# EAGLE design SVL-AuxiliaryPower (EAGLE 7.7.0)
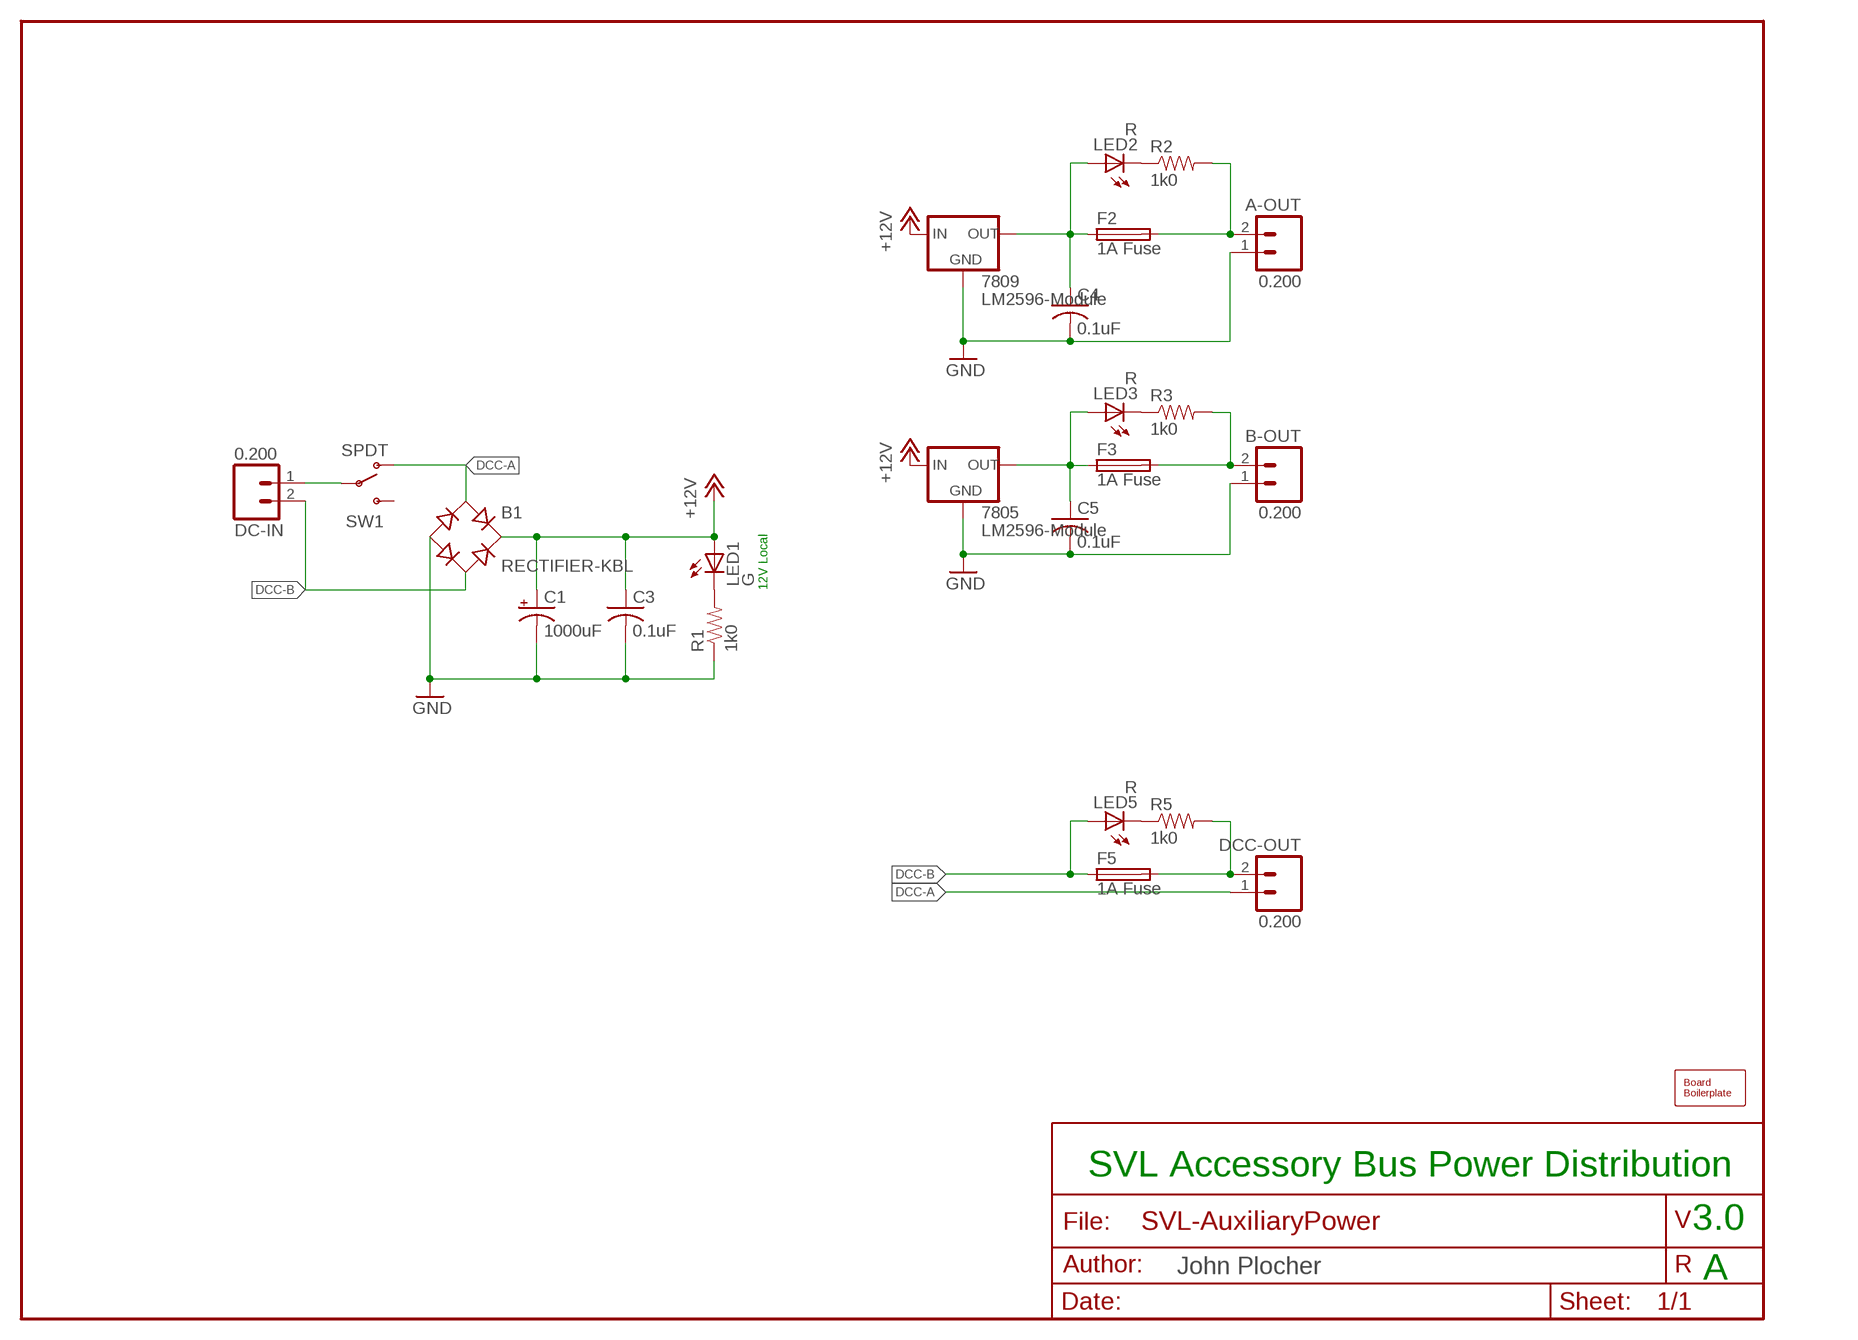
[diagram p0: schematic, sheet 1]

## Parts
7805  LM2596-Module  VREG_78XXLM2596  [LM2596-MODULE]
7809  LM2596-Module  VREG_78XXLM2596  [LM2596-MODULE]
A-OUT  0.200  CONNECTOR-M02508-LOCK  [MSTB2]
B1  RECTIFIER-KBL  [KBL]
B-OUT  0.200  CONNECTOR-M02508-LOCK  [MSTB2]
BOARD1  BOARD100X100  [BOARD-SEEED10X10]
C1  1000uF  CAP-POLPTH-5MM  [E5-10.5]
C3  0.1uF  CAPPTH1  [C050-024X044]
C4  0.1uF  CAPPTH1  [C050-024X044]
C5  0.1uF  CAPPTH1  [C050-024X044]
DC-IN  0.200  CONNECTOR-M02508-LOCK  [MSTB2]
DCC-OUT  0.200  CONNECTOR-M02508-LOCK  [MSTB2]
F2  1A Fuse  PICOFUSEPOLY  [POLYFUSE]
F3  1A Fuse  PICOFUSEPOLY  [POLYFUSE]
F5  1A Fuse  PICOFUSEPOLY  [POLYFUSE]
LED1  G  LEDLED5MM  [LED5MM]
LED2  R  LEDLED5MM  [LED5MM]
LED3  R  LEDLED5MM  [LED5MM]
LED5  R  LEDLED5MM  [LED5MM]
R1  1k0  RPTH04  [AXIAL-0.4-RES]
R2  1k0  RPTH04  [AXIAL-0.4-RES]
R3  1k0  RPTH04  [AXIAL-0.4-RES]
R5  1k0  RPTH04  [AXIAL-0.4-RES]
SW1  SPDT  SWITCH-SPSTPTH-508  [SWITCH-SPDT-508]

## Nets
+12V: 7805.IN+@1(IN) 7805.IN+@2(IN) 7809.IN+@1(IN) 7809.IN+@2(IN) B1.+ C1.+ C3.1 LED1.A
DCC-A: B1.AC1 DCC-OUT.1 SW1.1(O)
DCC-B: B1.AC2 DC-IN.2 F5.1 LED5.A
GND: 7805.GND@1(GND) 7805.GND@2(GND) 7805.GND@3(GND) 7805.GND@4(GND) 7809.GND@1(GND) 7809.GND@2(GND) 7809.GND@3(GND) 7809.GND@4(GND) A-OUT.1 B1.- B-OUT.1 C1.- C3.2 C4.2 C5.2 R1.P$1
N$2: A-OUT.2 F2.2 R2.P$2
N$3: B-OUT.2 F3.2 R3.P$2
N$4: DCC-OUT.2 F5.2 R5.P$2
N$5: 7809.OUT+@1(OUT) 7809.OUT+@2(OUT) C4.1 F2.1 LED2.A
N$7: 7805.OUT+@1(OUT) 7805.OUT+@2(OUT) C5.1 F3.1 LED3.A
N$8: LED2.K(C) R2.P$1
N$10: LED3.K(C) R3.P$1
N$12: LED1.K(C) R1.P$2
N$13: LED5.K(C) R5.P$1
UNSWITCHED-DCC-A: DC-IN.1 SW1.2(P)
Unconnected: SW1.3(S)

## Notes on the sheet
- 12V Local
- SVL Accessory Bus Power Distribution
- 3.0
- A

## Library data of the parts
7805 7809 = SPCoast:VREG_78XX: Voltage Regulator Standard 7805 5V regulator. IGO (Input Ground Output). Spark Fun Electronics SKU : COM-00107
A-OUT B-OUT DC-IN DCC-OUT = SPCoast:CONNECTOR-M02: PHOENIX CONNECTOR
B1 = rectifier:RECTIFIER-: Rectifier
BOARD1 = SPCoast:BOARD
C1 = SPCoast:CAP-POL*
C3-C5 = SPCoast:CAP*
F2 F3 F5 = SPCoast:PICOFUSE: PICOFUSE 19275, Wickmann
LED1-LED3 LED5 = SPCoast:LED*
R1-R3 R5 = SPCoast:R*: Resistor Basic schematic elements and footprints for 0603, 1206, and PTH 1/10th watt (small) resistors.
SW1 = SPCoast:SWITCH-SPST: SPST Switch Simple slide switch. Spark Fun Electronics SKU : COM-00102

## Board
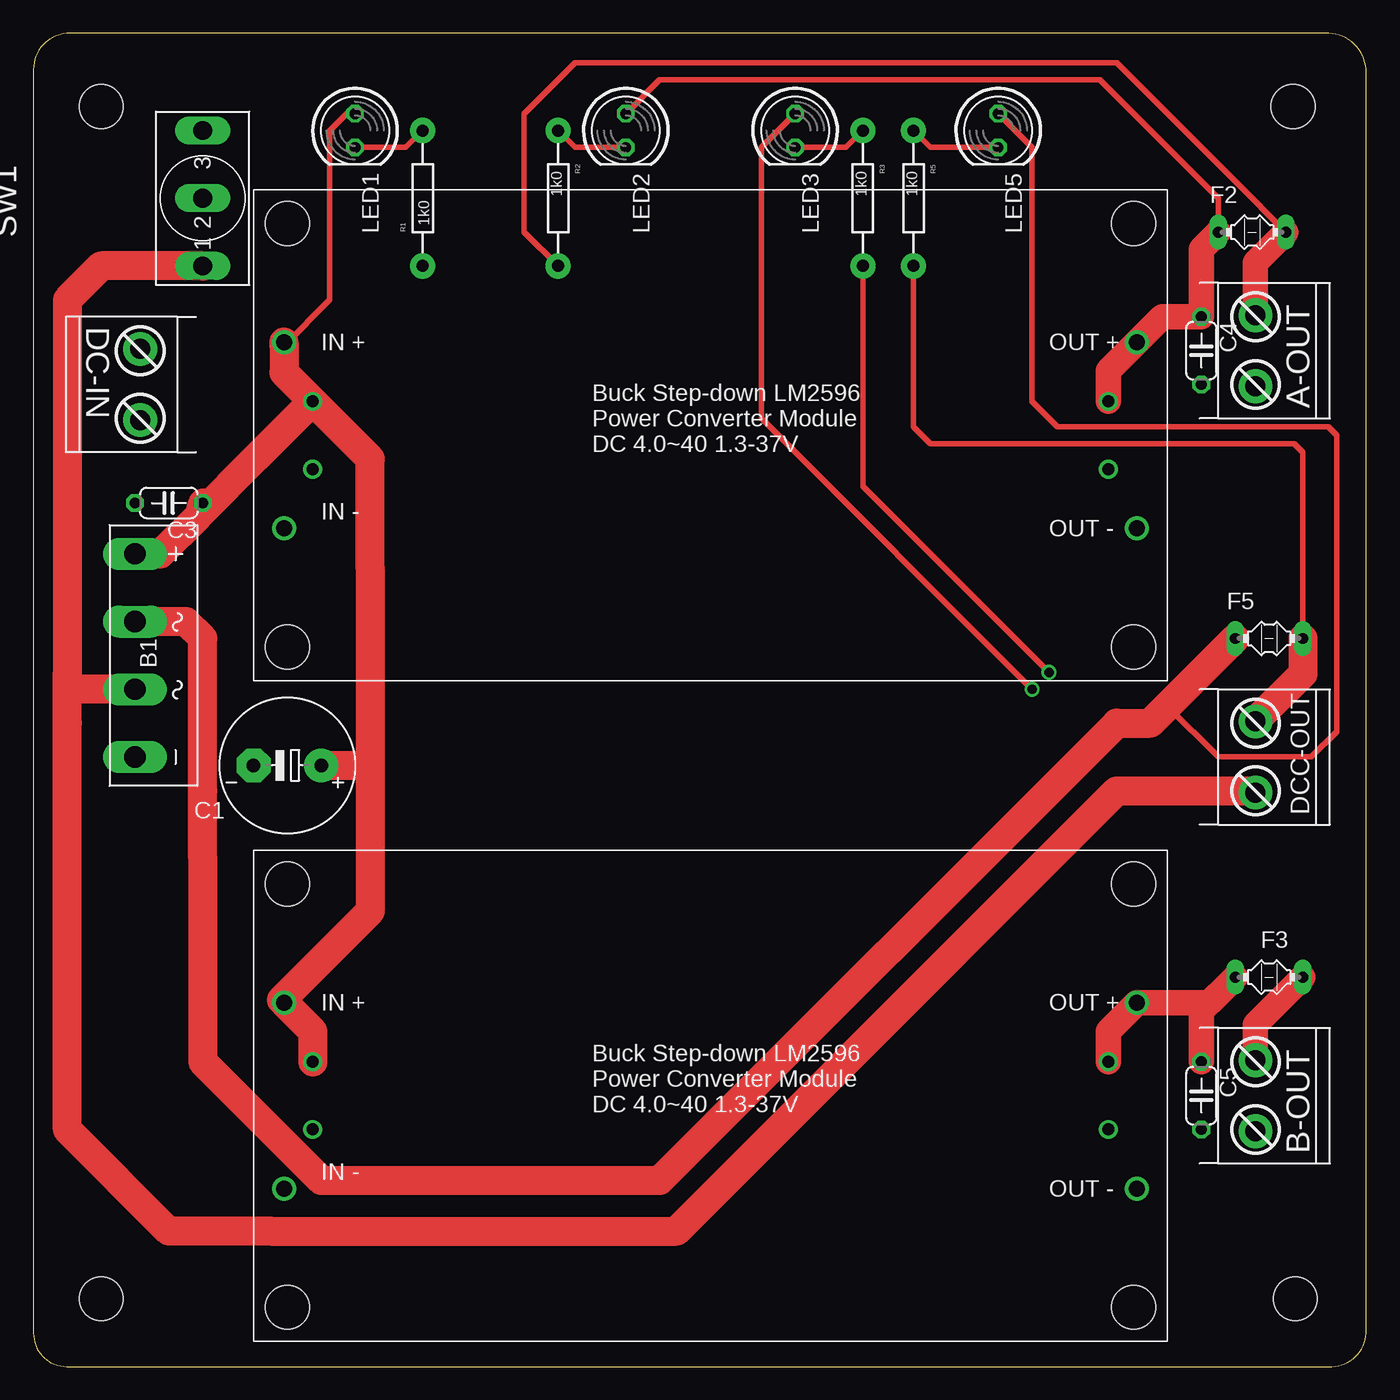
[diagram p1: board, top side]
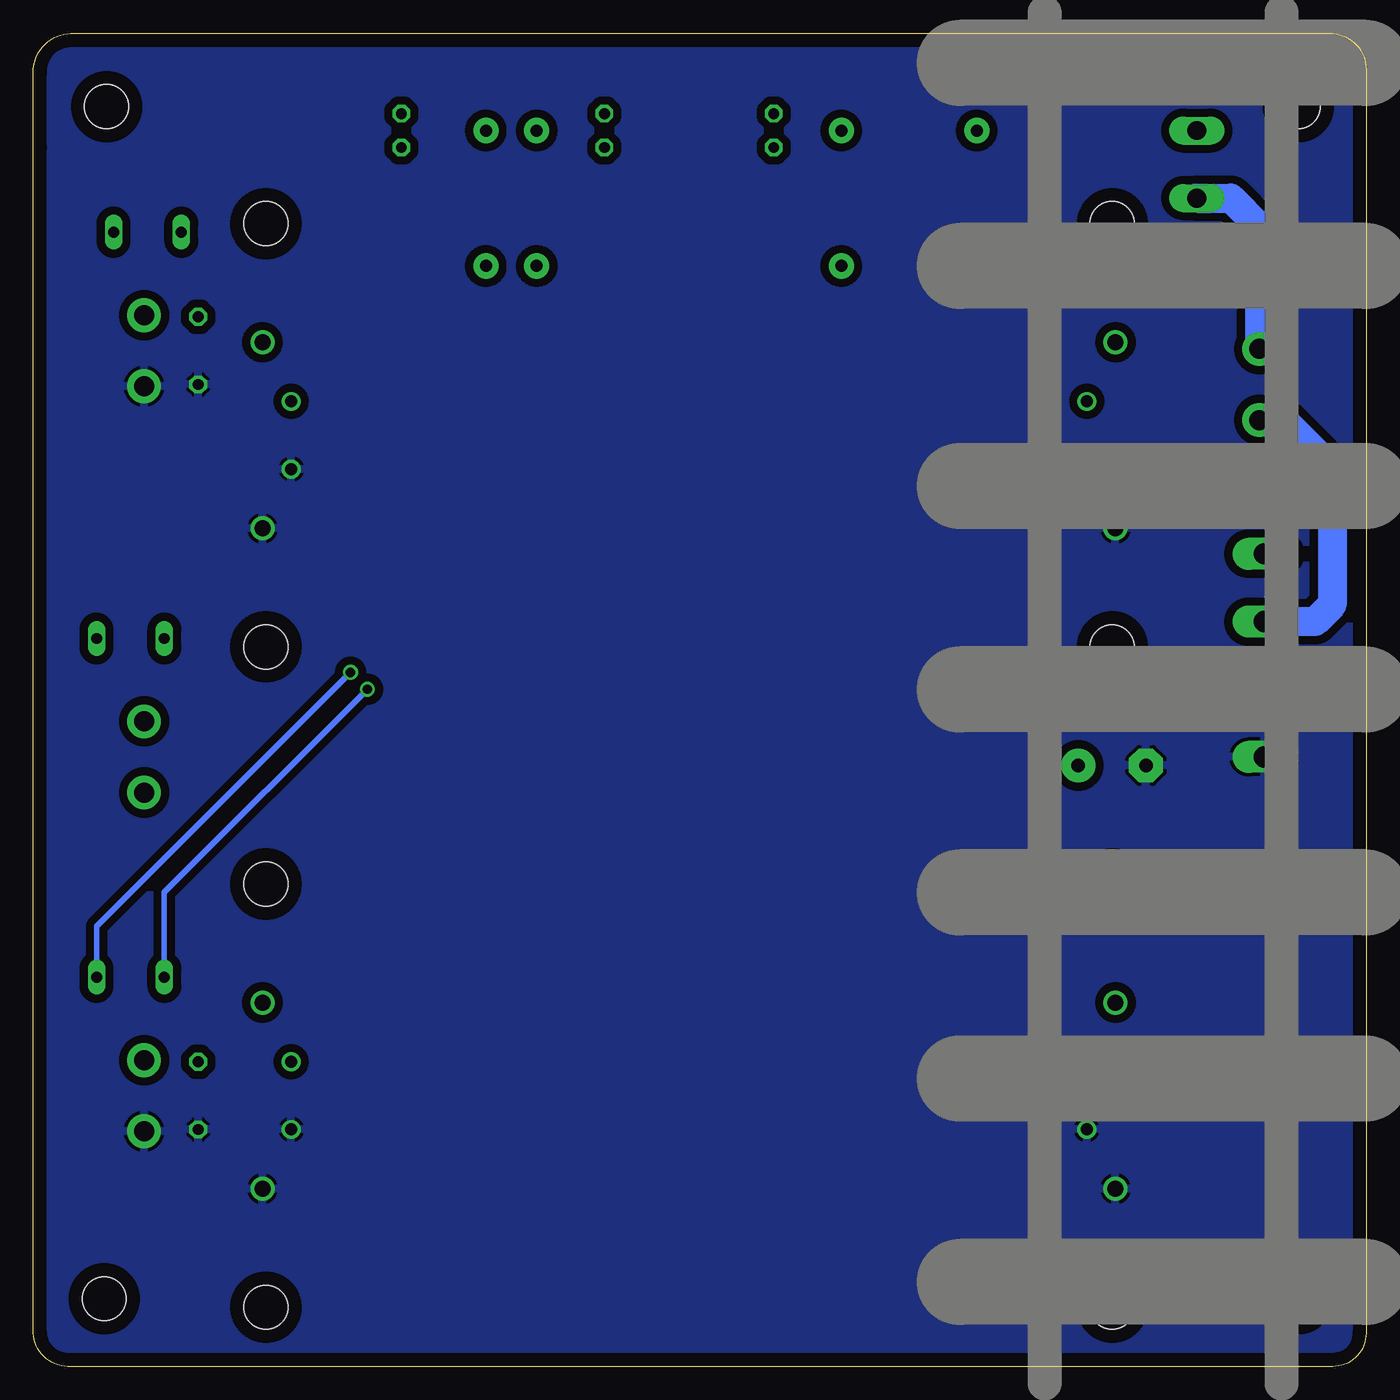
[diagram p2: board, bottom side, seen from below]

Size 100.01 x 100 mm. Coordinates in mm from the lower left corner, seen from the top.
Copper layers (1*16): Top 0.035mm / dielectric 1.5mm / Bottom 0.035mm
Design rules "default": minimum track width 10mil, minimum drill 24mil, track to track 8mil, track to pad 8mil, pad to pad 8mil, via to via 8mil, smd to smd 8mil, copper to edge 40mil, drill to drill 8mil, minimum pad ring 10mil, minimum via ring 8mil, stop-mask expansion 4mil, vias tented up to drill 0mil, thermal gap 10mil

### Footprints (pad centres in the part's own frame; a part is rotated, then mirrored left to right if it is on the bottom)
LM2596-MODULE = drill 0.9: GND@1 -29.845,-2.54; GND@4 29.845,-2.54; IN+@2 -29.845,2.54; OUT+@2 29.845,2.54 | drill 1.2: GND@2 -32.004,-6.985; GND@3 32.004,-6.985; IN+@1 -32.004,6.985; OUT+@1 32.004,6.985 | hole 3.3: -31.75,15.875; 31.75,15.875; -31.75,-15.875; 31.75,-15.875
MSTB2 = drill 1.5 pad 2.54: 1 -2.667,1.016; 2 2.667,1.016
KBL = drill 1.6 long: + -7.62,-1.27; - 7.62,-1.27; AC1 2.54,-1.27; AC2 -2.54,-1.27
BOARD-SEEED10X10 = hole 3.3: 94.676,5.08; 5.08,94.5; 94.5,94.5; 5.08,5.08
E5-10.5 = drill 1.016 pad 2.54: + -2.54,0 | drill 1.016 pad 2.54 octagon: - 2.54,0
C050-024X044 = drill 0.813 octagon: 1 -2.54,0; 2 2.54,0
POLYFUSE = drill 0.813 long: 1 -2.54,0; 2 2.54,0
LED5MM = drill 0.813 octagon: A -1.27,0; K 1.27,0
AXIAL-0.4-RES = drill 0.9 pad 1.88: P$1 -5.08,0; P$2 5.08,0
SWITCH-SPDT-508 = drill 1.397 long: 1 -5.08,0; 2 0,0; 3 5.08,0

### Placement (x,y rotation side)
7805  50.81,20.32 0 top
7809  50.81,69.85 0 top
A-OUT  92.72,76.2 90 top
B1  8.9,53.34 270 top
B-OUT  92.72,20.32 90 top
BOARD1  0.01,0 0 top
C1  19.06,45.09 180 top
C3  10.17,64.77 180 top
C4  87.64,76.2 270 top
C5  87.64,20.32 270 top
DC-IN  6.99,73.66 270 top
DCC-OUT  92.72,45.72 90 top
F2  91.45,85.09 0 top
F3  92.72,29.21 0 top
F5  92.72,54.61 0 top
LED1  24.14,92.71 270 top
LED2  44.46,92.71 270 top
LED3  57.16,92.71 270 top
LED5  72.4,92.71 270 top
R1  29.22,87.63 90 top
R2  39.38,87.63 270 top
R3  62.24,87.63 270 top
R5  66.05,87.63 270 top
SW1  12.71,87.63 90 top

### Tracks (layer width: path | path; a pad name or v marks a point on that pad's centre or on a via)
+12V
  Top 0.406: 7809.IN+@1 18.81,76.58 22.23,80.01 22.23,86.36 22.23,88.27 22.23,92.71 23.5,93.98 LED1.A
  Top 2.184: B1.+ 9.53,60.96 12.39,63.82 | 12.39,63.82 16.84,68.27 7809.IN+@2 | 7809.IN+@1 18.81,76.58 18.81,74.55 7809.IN+@2 | 7805.IN+@2 20.96,25.15 7805.IN+@1 18.61,27.5 25.28,34.17 25.28,40.64 25.28,45.09 | 25.28,45.09 25.28,59.82 25.28,68.08 7809.IN+@2 | C3.1 12.39,63.82 | C1.+ 25.28,45.09
DCC-A
  Top 1.93: 91.58,43.18 DCC-OUT.1
  Top 2.184: 2.55,50.8 2.55,48.26 2.55,17.78 10.17,10.16 17.79,10.16 48.27,10.16 81.29,43.18 91.58,43.18 | 2.55,50.8 2.55,52.07 2.55,66.04 2.55,80.01 5.09,82.55 SW1.1 | B1.AC1 2.55,50.8
DCC-B
  Top 0.406: LED5.A 74.94,91.44 74.94,72.39 76.84,70.49 97.16,70.49 97.8,69.85 97.8,47.63 95.89,45.72 88.91,45.72 85.1,49.53
  Top 2.184: B1.AC2 11.44,55.88 12.71,54.61 12.71,43.18 12.71,38.1 12.71,22.86 21.6,13.97 47,13.97 81.29,48.26 83.83,48.26 85.1,49.53 F5.1
  Bottom 2.184: DC-IN.2 6.23,71 2.55,67.31 2.55,57.15 3.82,55.88 B1.AC2
GND
  pour Bottom (isolate 0.61): 0.01,100.33 0.01,0 100.34,0 100.34,100.33
N$2
  Top 0.406: R2.P$2 36.84,85.09 36.84,93.98 40.65,97.79 81.29,97.79 90.18,88.9 F2.2
  Top 1.93: F2.2 91.7,82.81 A-OUT.2
N$3  (via drill 0.7)
  Top 0.406: R3.P$2 62.24,66.04 66.05,62.23 v76.21,52.07
  Top 1.93: F3.2 91.7,25.66 B-OUT.2
  Bottom 0.406: v76.21,52.07 95.26,33.02 F3.2
N$4
  Top 0.406: F5.2 95.26,57.15 95.26,68.58 94.62,69.22 67.32,69.22 66.05,70.49 R5.P$2
  Top 2.184: F5.2 95.26,51.95 DCC-OUT.2
N$5
  Top 0.406: LED2.A 47,96.52 80.02,96.52 88.91,87.63 F2.1
  Top 1.93: 7809.OUT+@2 80.65,74.68 7809.OUT+@1 84.72,78.74 C4.1 87.64,83.82 F2.1
N$7  (via drill 0.7)
  Top 0.406: LED3.A 54.62,91.44 54.62,71.12 v74.94,50.8
  Top 1.93: C5.1 87.64,26.67 F3.1 88.27,27.31 7805.OUT+@1 80.65,25.15 7805.OUT+@2
  Bottom 0.406: v74.94,50.8 90.18,35.56 F3.1
N$8
  Top 0.406: LED2.K 40.65,91.44 R2.P$1
N$10
  Top 0.406: LED3.K 60.97,91.44 R3.P$1
N$12
  Top 0.406: LED1.K 27.95,91.44 R1.P$2
N$13
  Top 0.406: LED5.K 67.32,91.44 R5.P$1
UNSWITCHED-DCC-A
  Bottom 2.184: SW1.2 10.17,87.63 8.01,85.47 DC-IN.1

### Text on the board
tDocu: Master | Power | Short: | A | B | DCC | ON | DCC | + - | DCC from Power Bus | A B | Regulator / "A" | Regulated / "A" | Silicon Valley Lines | Auxiliary Power Interface | DCC | A B | 1A Max output | Regulator / "B" | + - | Regulated / "B"
bDocu: www . SPCoast . com | Silicon Valley Lines | Auxiliary Power Interface | If it isn't overcomplicated, / it isn't worth doing! | John Plocher / 2017-05